# Altium schematic sheet Sheet1.SchDoc: Sensor FC-51
size A4; DocumentNumber: 1; SheetNumber: 1; SheetTotal: 1
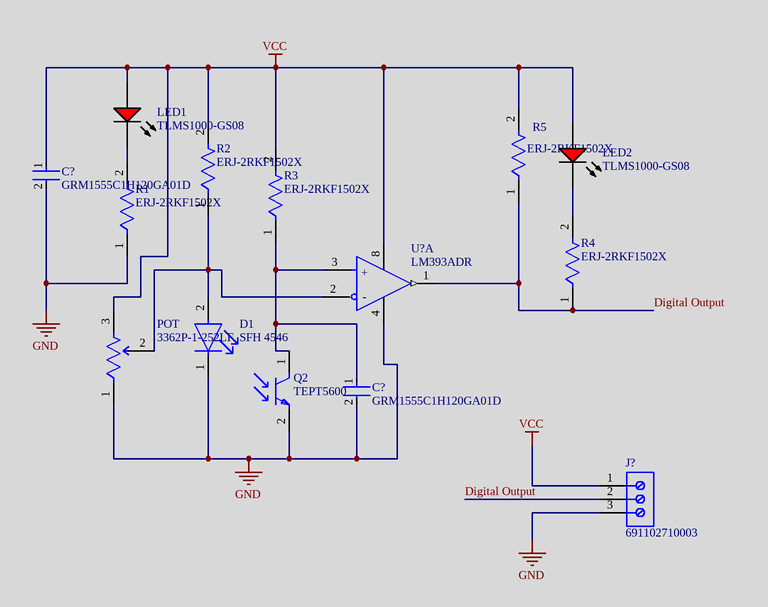
[diagram p0: Sheet1.SchDoc]

## Parts
(Parts that share a designator on the sheet are numbered #1, #2 ... from top to bottom, then left to right.)
C?#1  GRM1555C1H120GA01D  [FP-GRM155-0_05-MFG]
C?#2  GRM1555C1H120GA01D  [FP-GRM155-0_05-MFG]
D1  SFH 4546  [FP-SFH_4546-MFG]
J?  691102710003  [691102710003]
LED1  TLMS1000-GS08  [VISH-TLMS1000_V]
LED2  TLMS1000-GS08  [VISH-TLMS1000_V]
POT  3362P-1-252LF  [FP-3362P-MFG]
Q2  TEPT5600  [FP-6_544-5185_03-4-MFG]
R1  ERJ-2RKF1502X  [FP-ERJ2R-MFG]
R2  ERJ-2RKF1502X  [FP-ERJ2R-MFG]
R3  ERJ-2RKF1502X  [FP-ERJ2R-MFG]
R4  ERJ-2RKF1502X  [FP-ERJ2R-MFG]
R5  ERJ-2RKF1502X  [FP-ERJ2R-MFG]
U?  LM393ADR  [FP-D0008A-MFG]  (part A of 2)

## Nets
GND: C?#1.2 C?#2.2 D1.1(C) J?.3 POT.1(CCW) Q2.2(E) R1.1 U?.4(GND)
VCC: C?#1.1 J?.1 LED1.1(A) LED2.1(A) POT.3(CW) R2.2 R3.2 R5.2 U?.8(VCC)
Digital Output: J?.2 R4.1 R5.1 U?.1(1OUT)
NetC?#2_1: C?#2.1 Q2.1(C) R3.1 U?.3(1IN+)
NetD1_2: D1.2(A) POT.2(WIPER) R2.1 U?.2(1IN-)
NetLED1_2: LED1.2(K) R1.2
NetLED2_2: LED2.2(K) R4.2

## Notes on the sheet
- (in symbol CMP-04896-000011-1, part A) +; -

## Library data of the parts
C?#1 C?#2 = CMP-2008-03945-2: CAP CER 12PF 50V C0G/NP0 0402; Tolerance: 2%; Dielectric: C0G; Material: Ceramic; Termination: SMD/SMT; Mount: Surface Mount; REACH SVHC: No SVHC; Depth: 0.5mm; Case Code (Metric): 1005; Voltage Rating: 50V; Height: 0.5mm; Voltage Rating (DC): 50V; Case Code (Imperial): 0402; Package Quantity: 10000; Construction: Flat; Thickness: 0.022inch; Length: 1mm; Min Operating Temperature: -55°C; Width: 0.5mm; Lead Free: Lead Free; Capacitance: 12pF; Case/Package: 0402; Packaging: Tape and Reel; Series: GRM; Voltage: 50V; Radiation Hardening: No; Max Operating Temperature: 125°C
D1 = CMP-62016-000058-1: EMITTER IR 950NM 100MA RADIAL; Number of LEDs: 1; Forward Voltage: 1.5V; Lens Style: Dome; Power Dissipation: 180W; Reverse Voltage: 5V; Viewing Angle: 40°; Touchscreen: Infrared (IR); Fall Time: 12ns; Power Rating: 180mW; RoHS Compliant: Yes; Forward Current: 100mA; Series: -; Max Operating Temperature: 100°C; Packaging: Bulk; Min Operating Temperature: -40°C; Depth: 5.7mm; Mount: Through Hole; Length: 5.7mm; Case/Package: Radial; Test Current: 100mA; Number of Elements: 1; Package Quantity: 1000; Contact Plating: Tin; Rise Time: 12ns; Max Power Dissipation: 180mW; Orientation: Top View; Wavelength: 950nm; Number of Pins: 2; Radiation Hardening: No
J? = CMP-1502-03259-2: NexarPartId: 8917707; Current: 15A; Stripping Length: -6mm; Wire/Cable Gauge: 22AWG; Wire Gauge (Min): 14AWG; Pitch: 5.0038mm; Number of Positions Per Level: 3; Plating: Steel; Voltage Rating: 300V; Number of Levels: 1; RoHS: Compliant; Mount: Through Hole; Color: Blue; Length: 7.5mm; Packaging: Box; Min Operating Temperature: -40°C; Housing Material: Nylon; REACH SVHC: Unknown; Current Rating: 15A; Contact Material: Brass; Width: 16.2mm; Height: 13.4mm; Lead Pitch: 5mm; Number of Contacts: 3; Number of Pins: 3; Contact Plating: Tin; Voltage: 300V; Termination: Screw; Max Operating Temperature: 105°C; Wire Gauge (Max): 22AWG
LED1 LED2 = CMP-2000-07254-1: Low Current LED, 40 mW, 1.8 V, -40 to 100 degC, 2-Pin SMD (0603), RoHS, Tape and Reel; Manufacturer: Vishay; Lens Shape: Rectangular; Automotive Qualification Standard: AEC-Q100; Wavelength Typ: 636nm; SVHC: ToBeAdvised; LED Colour: Red; Bulb Size: 1.6mmx0.8mm; Forward Voltage: 1.8V; Luminous Intensity: 4mcd; Forward Current If: 2mA; Viewing Angle: 80°; Datasheet Version: Rev. 1.7, 02/2011; Datasheet URL: https://datasheet.ciiva.com/5798/1698881-5798337.pdf; LED Mounting: SMD; Packaging: CutTape; Package Reference: TLMS1000; Manufacturer URL: http://www.vishay.com/; Mounting Technology: SurfaceMount; Product Range: -; Package Description: 2-Pin Surface Mount Device, Body 1.6 x 0.8 mm; MSL: MSL2-1year
POT = CMP-00059-10485830-1: 3362P-1-252LF 1/4" Sq, Thru-Hole, TRIMMER, 2.5 Kilohms, Cermet, Single Turn; Temperature Coefficient: 100ppm/°C; Power Rating: 500mW; Tolerance: 10%; Resistance: 2.5kΩ; Number of Turns: 1; Depth: 6.99mm; Min Operating Temperature: -55°C; Radiation Hardening: No; Max Operating Temperature: 125°C; Termination: Pin; NexarPartId: 10485830; Height: 4.699mm; Length: 6.6mm; RoHS: Compliant; Mount: Through Hole; Width: 6.604mm; Schedule B: 8533400080, 8533400080; REACH SVHC: No SVHC; Composition: Cermet; Max Power Dissipation: 500mW; Military Standard: Not
Q2 = CMP-02533-000004-1: SENSOR PHOTO 570NM TOP VIEW RAD; Number of Channels: 1; Collector Emitter Voltage (VCEO): 6V; Output Type: Analog; Power Consumption: 100mW; Max Collector Current: 20mA; Lens Style: Domed; Polarity: NPN; Dark Current: 50nA; Viewing Angle: 20°; Operating Supply Voltage: 5V; Package Material: SILICON; Wavelength: 570nm; Width: 5.75mm; Power Dissipation: 100mW; Package Quantity: 4000; Radiation Hardening: No; RoHS Compliant: Yes; Lead Free: Lead Free; Max Power Dissipation: 100mW; Max Operating Temperature: 85°C; Length: 5.75mm; Case/Package: Radial; Number of Elements: 1; Number of Pins: 2; Min Operating Temperature: -40°C; Mount: Through Hole; Height: 8mm; Orientation: Top View; Series: -; Collector Emitter Breakdown Voltage: 6V; Packaging: Bulk
R1-R5 = CMP-2002-00694-4: RES SMD 15K OHM 1% 1/10W 0402; Manufacturer: Panasonic; Automotive Grade: Grade 0; Voltage Rating: 50V; Resistance: 15kΩ; Temperature Coefficient: 100ppm/°C; Power Rating: 0.1W; Value: 15kΩ; ComponentLink2URL: https://industrial.panasonic.com/cdbs/www-data/pdf/RDA0000/AOA0000C304.pdf; Automotive: Yes; Temperature: -55°C to +155°C; Height: 0.4mm; Digikey Description: RES SMD 15K OHM 1% 1/10W 0402; Category: Res; Device Class L2: Resistors; Device Class L1: Passive Components; Package: ERJ2R; Temperature Range Low: -55°C; Tolerance: 1%; Series: ERJ; Manufacturer Part Number: ERJ-2RKF1502X; Footprint Url: https://b2b-api.panasonic.eu/file_stream/pids/fileversion/1180; Mouser Description: Res Thick Film 1.0 x 0.5 mm 15K Ohm 1% 0.1W(1/10W) 100ppm/ C Molded SMD Punched Carrier T/R; Composition: Thick Film; Lead Free: Yes; Device Class L3: Chip SMD Resistors; Octopart: https://octopart.com/erj-2rkf1502x-panasonic-55404985; RoHS: TRUE; Temperature Range High: +155°C; ComponentLink2Description: Datasheet
U? = CMP-04896-000011-1: IC DUAL DIFF COMPARATOR 8-SOIC; Manufacturer: Texas Instruments; Min Supply Voltage: 2V; Nominal Supply Current: 0.6mA; Input Offset Voltage: 1mV; Max Junction Temp: +150°C; Number Of Channels: 2; Max Supply Voltage: 30V; Input Bias Current: -0.025uA; Response Time: 1.3us; Standoff Height: 0.11mm; Voltage Gain: 200V/mV; Temperature Range High: +70°C; Package: D0008A; Digikey Description: IC DUAL DIFF COMPARATOR 8-SOIC; Height: 1.75mm; ComponentLink2URL: http://www.ti.com/lit/ds/symlink/lm393a.pdf; ComponentLink2Description: Datasheet; Mouser Description: Analog Comparators Dual Diff A Grade; Temperature: 0°C to +70°C; Ambient Temperature Range Low: 0°C; Device Class L3: Comparators; Octopart: https://octopart.com/lm393adr-texas+instruments-428362; Temperature Range Low: 0°C; RoHS: TRUE; Ambient Temperature Range High: +70°C; Device Class L1: Integrated Circuits (ICs); Device Class L2: Linear ICs; Category: IC; Manufacturer Part Number: LM393ADR; Automotive: No; Lead Free: Yes